# EAGLE design PS2 (EAGLE 8.0.0)
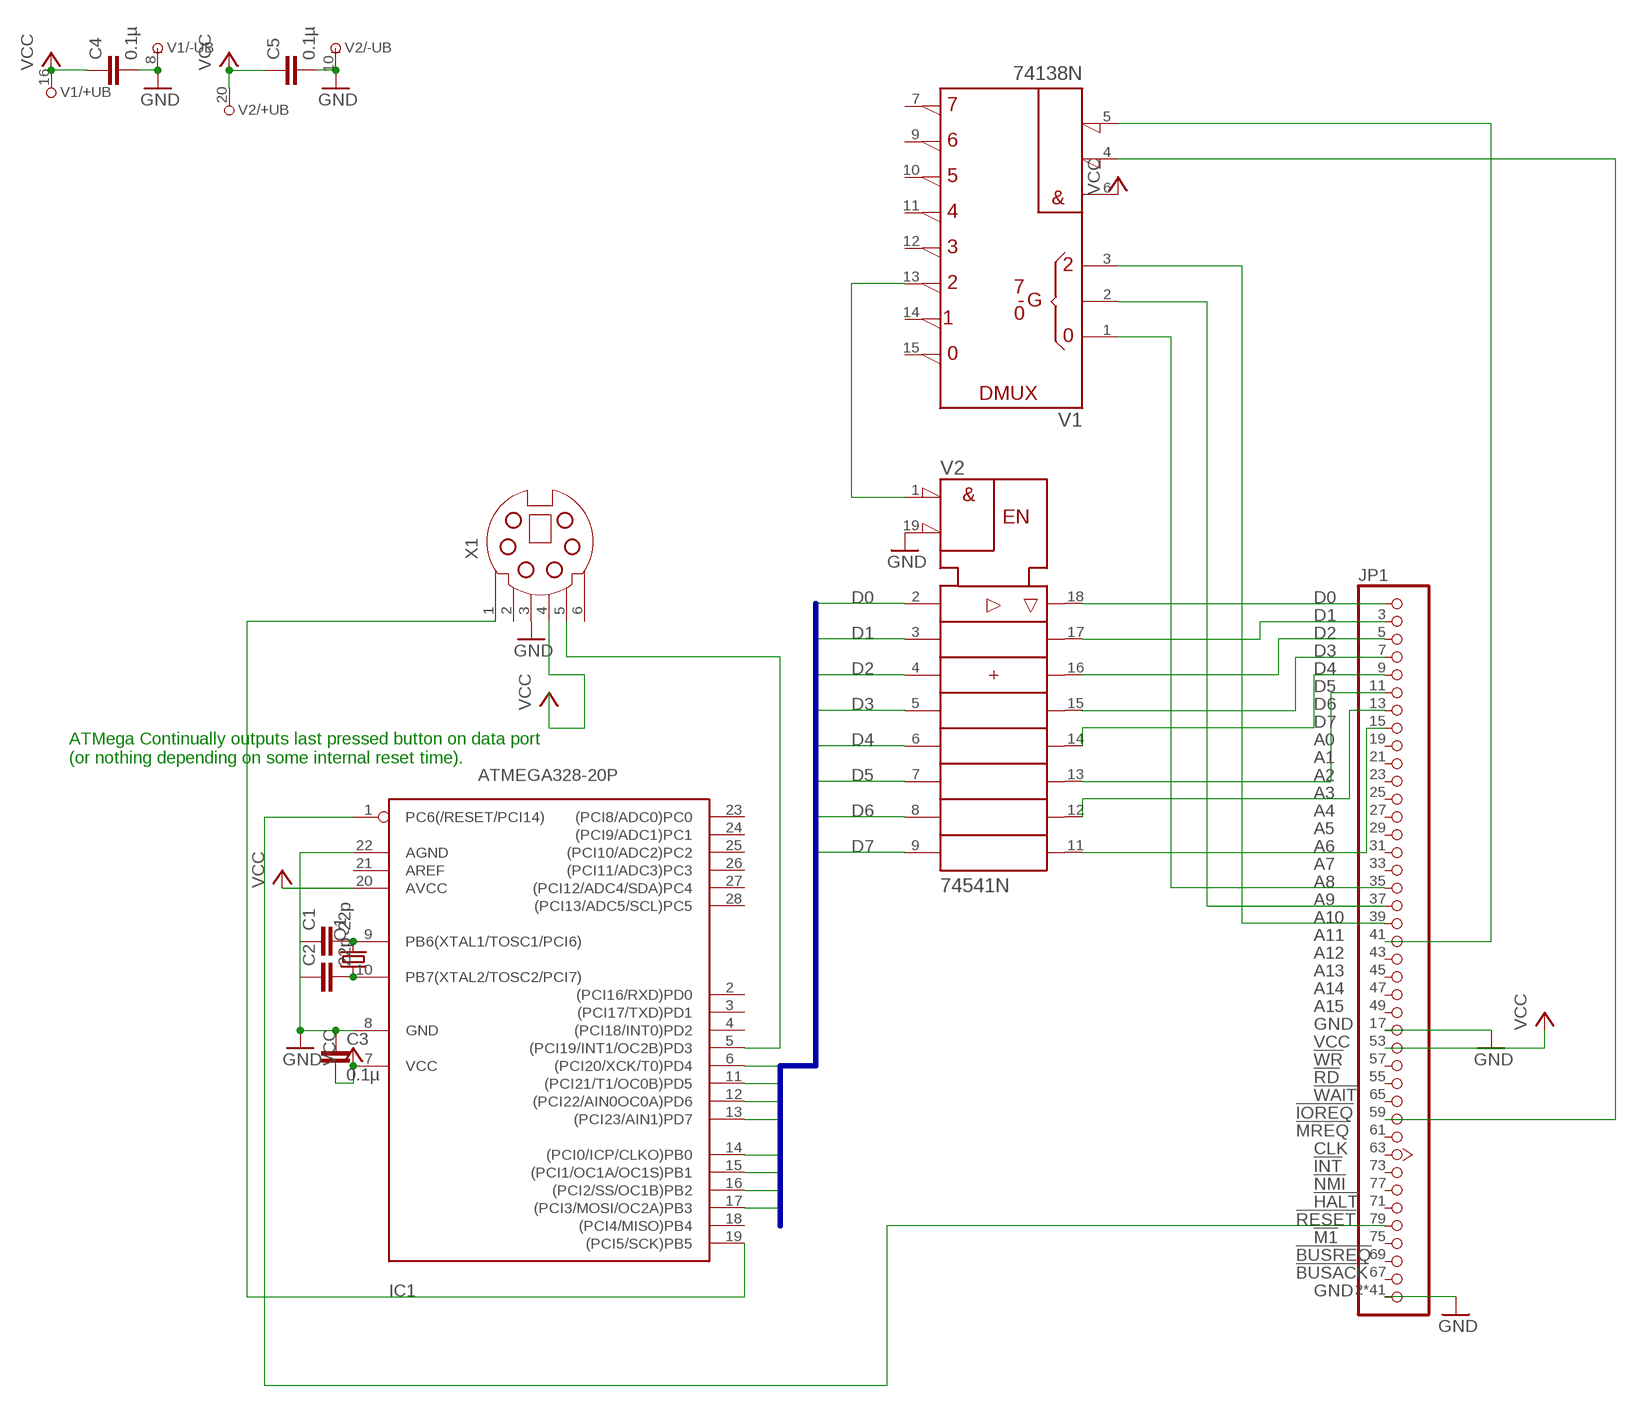
[diagram p0: schematic, sheet 1]

## Parts
C1  22p  C5/3  [C5B3]
C2  22p  C5/3  [C5B3]
C3  0.1µ  C5/3  [C5B3]
C4  0.1µ  C5/3  [C5B3]
C5  0.1µ  C5/3  [C5B3]
IC1  ATMEGA328-20P  [DIL28-3]
JP1  JEANNECTOR/90  [2X25/90]
Q1  CRYSTALHC49S  [HC49/S]
V1  74138N  [DIL16]
V2  74541N  [DIL20]
X1  MDSSV-F06  [SSV-BC06]

## Nets
D0: IC1.6((PCI20/XCK/T0)PD4) V2.2(A1)
D1: IC1.11((PCI21/T1/OC0B)PD5) V2.3(A2)
D2: IC1.12((PCI22/AIN0OC0A)PD6) V2.4(A3)
D3: IC1.13((PCI23/AIN1)PD7) V2.5(A4)
D4: IC1.14((PCI0/ICP/CLKO)PB0) V2.6(A5)
D5: IC1.15((PCI1/OC1A/OC1S)PB1) V2.7(A6)
D6: IC1.16((PCI2/SS/OC1B)PB2) V2.8(A7)
D7: IC1.17((PCI3/MOSI/OC2A)PB3) V2.9(A8)
GND: C3.1 C4.2 C5.2 IC1.8(GND) IC1.22(AGND) JP1.2(GND) JP1.4(GND) JP1.6(GND) JP1.8(GND) JP1.10(GND) JP1.12(GND) JP1.14(GND) JP1.16(GND) JP1.17(GND) JP1.18(GND) JP1.20(GND) JP1.22(GND) JP1.24(GND) JP1.26(GND) JP1.28(GND) JP1.30(GND) JP1.32(GND) JP1.34(GND) JP1.36(GND) JP1.38(GND) JP1.40(GND) JP1.42(GND) JP1.44(GND) JP1.46(GND) JP1.48(GND) JP1.50(GND) JP1.51(GND) JP1.52(GND) JP1.54(GND) JP1.56(GND) JP1.58(GND) JP1.60(GND) JP1.62(GND) JP1.64(GND) JP1.66(GND) JP1.68(GND) JP1.70(GND) JP1.72(GND) JP1.74(GND) JP1.76(GND) JP1.78(GND) JP1.80(GND) V1.8(-UB) V2.10(-UB) V2.19(!G2) X1.3
N$1: JP1.35(A8) V1.1(A)
N$2: JP1.37(A9) V1.2(B)
N$3: JP1.39(A10) V1.3(C)
N$4: IC1.5((PCI19/INT1/OC2B)PD3) X1.5
N$5: V1.13(Y2) V2.1(!G1)
N$6: IC1.19((PCI5/SCK)PB5) X1.1
N$7: JP1.59(!IOREQ) V1.4(!G2A)
N$8: JP1.41(A11) V1.5(!G2B)
N$9: JP1.1(D0) V2.18(Y1)
N$10: JP1.3(D1) V2.17(Y2)
N$11: JP1.5(D2) V2.16(Y3)
N$12: JP1.7(D3) V2.15(Y4)
N$13: JP1.9(D4) V2.14(Y5)
N$14: JP1.11(D5) V2.13(Y6)
N$15: JP1.13(D6) V2.12(Y7)
N$16: JP1.15(D7) V2.11(Y8)
N$17: IC1.1(PC6(/RESET/PCI14)) JP1.79(!RESET)
N$18: C1.2 IC1.9(PB6(XTAL1/TOSC1/PCI6)) Q1.2
N$19: C2.2 IC1.10(PB7(XTAL2/TOSC2/PCI7)) Q1.1
VCC: C3.2 C4.1 C5.1 IC1.7(VCC) IC1.20(AVCC) JP1.53(VCC) V1.6(G1) V1.16(+UB) V2.20(+UB) X1.4
Unconnected: C1.1 C2.1 IC1.2((PCI16/RXD)PD0) IC1.3((PCI17/TXD)PD1) IC1.4((PCI18/INT0)PD2) IC1.18((PCI4/MISO)PB4) IC1.21(AREF) IC1.23((PCI8/ADC0)PC0) IC1.24((PCI9/ADC1)PC1) IC1.25((PCI10/ADC2)PC2) IC1.26((PCI11/ADC3)PC3) IC1.27((PCI12/ADC4/SDA)PC4) IC1.28((PCI13/ADC5/SCL)PC5) JP1.19(A0) JP1.21(A1) JP1.23(A2) JP1.25(A3) JP1.27(A4) JP1.29(A5) JP1.31(A6) JP1.33(A7) JP1.43(A12) JP1.45(A13) JP1.47(A14) JP1.49(A15) JP1.55(!RD) JP1.57(!WR) JP1.61(!MREQ) JP1.63(CLK) JP1.65(!WAIT) JP1.67(!BUSACK) JP1.69(!BUSRQ) JP1.71(!HALT) JP1.73(!INT) JP1.75(!M1) JP1.77(!NMI) V1.7(Y7) V1.9(Y6) V1.10(Y5) V1.11(Y4) V1.12(Y3) V1.14(Y1) V1.15(Y0) X1.2 X1.6

## Buses
D[0..7]

## Notes on the sheet
- ATMega Continually outputs last pressed button on data port
  (or nothing depending on some internal reset time).

## Library data of the parts
C1-C5 = capacitor-wima:C: CAPACITOR naming: grid - package width
IC1 = atmega328:ATMEGA328*P: MICROCONTROLLER 32 kBytes FLASH 2 kBytes SRAM 1 kBytes EEPROM USART 8-channel 10 bit ADC
JP1 = jean:JEANNECTOR: PIN HEADER
Q1 = crystal:CRYSTAL: CRYSTAL; OC_FARNELL: 1667008; OC_NEWARK: unknown
V1 = 74ttl-din:74*138: 3-line to 8-line DECODER/DEMULTIPLEXER
V2 = 74ttl-din:74*541: Octal BUFFER and LINE DRIVER, 3-state
X1 = con-yamaichi:MDSSV-F06: YAMAICHI CONNECTOR; OC_FARNELL: unknown; OC_NEWARK: unknown

## Board
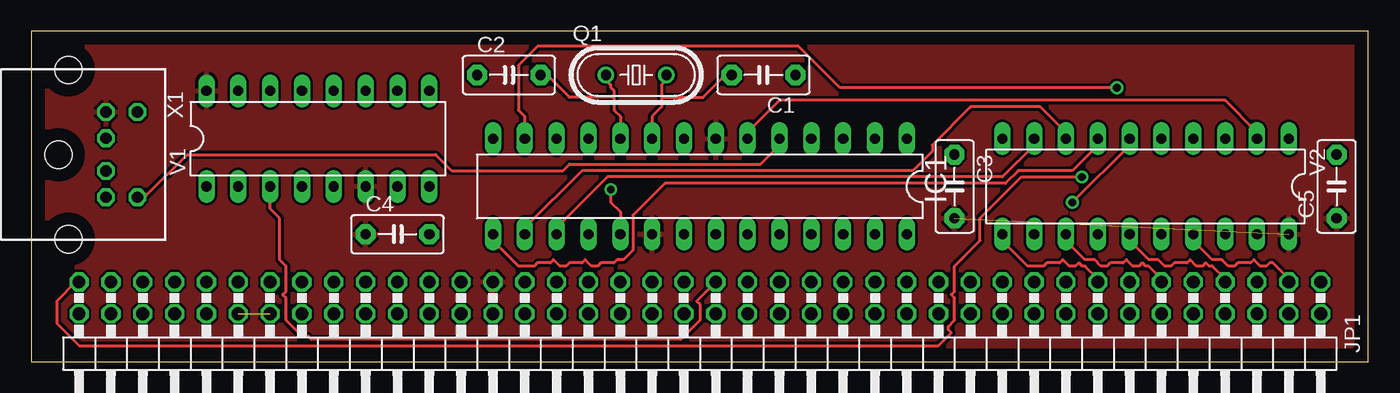
[diagram p1: board, top side]
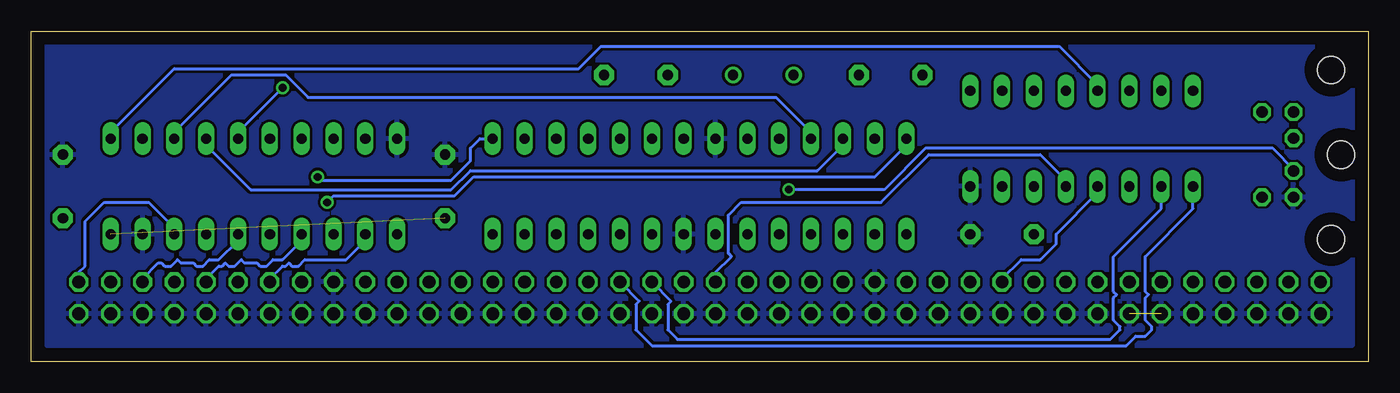
[diagram p2: board, bottom side, seen from below]

Size 106.66 x 26.34 mm. Coordinates in mm from the lower left corner, seen from the top.
Outline: 0,0 106.66,0 106.66,26.34 0,26.34 0,0
Copper layers (1*16): Top 0.035mm / dielectric 1.5mm / Bottom 0.035mm
Design rules "default": minimum track width 10mil, minimum drill 24mil, track to track 8mil, track to pad 8mil, pad to pad 8mil, via to via 8mil, smd to smd 8mil, copper to edge 40mil, drill to drill 8mil, minimum pad ring 10mil, minimum via ring 8mil, stop-mask expansion 4mil, vias tented up to drill 0mil, thermal gap 10mil

### Footprints (pad centres in the part's own frame; a part is rotated, then mirrored left to right if it is on the bottom)
C5B3 = drill 0.813 pad 1.6 octagon: 1 -2.54,0; 2 2.54,0
DIL28-3 = drill 0.813 long: 1 -16.51,-3.81; 2 -13.97,-3.81; 3 -11.43,-3.81; 4 -8.89,-3.81; 5 -6.35,-3.81; 6 -3.81,-3.81; 7 -1.27,-3.81; 8 1.27,-3.81; 9 3.81,-3.81; 10 6.35,-3.81; 11 8.89,-3.81; 12 11.43,-3.81; 13 13.97,-3.81; 14 16.51,-3.81; 15 16.51,3.81; 16 13.97,3.81; 17 11.43,3.81; 18 8.89,3.81; 19 6.35,3.81; 20 3.81,3.81; 21 1.27,3.81; 22 -1.27,3.81; 23 -3.81,3.81; 24 -6.35,3.81; 25 -8.89,3.81; 26 -11.43,3.81; 27 -13.97,3.81; 28 -16.51,3.81
2X25/90 = drill 1.016 octagon: 1 -29.21,-6.35; 2 -29.21,-3.81; 3 -26.67,-6.35; 4 -26.67,-3.81; 5 -24.13,-6.35; 6 -24.13,-3.81; 7 -21.59,-6.35; 8 -21.59,-3.81; 9 -19.05,-6.35; 10 -19.05,-3.81; 11 -16.51,-6.35; 12 -16.51,-3.81; 13 -13.97,-6.35; 14 -13.97,-3.81; 15 -11.43,-6.35; 16 -11.43,-3.81; 17 -8.89,-6.35; 18 -8.89,-3.81; 19 -6.35,-6.35; 20 -6.35,-3.81; 21 -3.81,-6.35; 22 -3.81,-3.81; 23 -1.27,-6.35; 24 -1.27,-3.81; 25 1.27,-6.35; 26 1.27,-3.81; 27 3.81,-6.35; 28 3.81,-3.81; 29 6.35,-6.35; 30 6.35,-3.81; 31 8.89,-6.35; 32 8.89,-3.81; 33 11.43,-6.35; 34 11.43,-3.81; 35 13.97,-6.35; 36 13.97,-3.81; 37 16.51,-6.35; 38 16.51,-3.81; 39 19.05,-6.35; 40 19.05,-3.81; 41 21.59,-6.35; 42 21.59,-3.81; 43 24.13,-6.35; 44 24.13,-3.81; 45 26.67,-6.35; 46 26.67,-3.81; 47 29.21,-6.35; 48 29.21,-3.81; 49 31.75,-6.35; 50 31.75,-3.81; 51 34.29,-6.35; 52 34.29,-3.81; 53 36.83,-6.35; 54 36.83,-3.81; 55 39.37,-6.35; 56 39.37,-3.81; 57 41.91,-6.35; 58 41.91,-3.81; 59 44.45,-6.35; 60 44.45,-3.81; 61 46.99,-6.35; 62 46.99,-3.81; 63 49.53,-6.35; 64 49.53,-3.81; 65 52.07,-6.35; 66 52.07,-3.81; 67 54.61,-6.35; 68 54.61,-3.81; 69 57.15,-6.35; 70 57.15,-3.81; 71 59.69,-6.35; 72 59.69,-3.81; 73 62.23,-6.35; 74 62.23,-3.81; 75 64.77,-6.35; 76 64.77,-3.81; 77 67.31,-6.35; 78 67.31,-3.81; 79 69.85,-6.35; 80 69.85,-3.81
HC49/S = drill 0.813: 1 -2.413,0; 2 2.413,0
DIL16 = drill 0.813 long: 1 -8.89,-3.81; 2 -6.35,-3.81; 3 -3.81,-3.81; 4 -1.27,-3.81; 5 1.27,-3.81; 6 3.81,-3.81; 7 6.35,-3.81; 8 8.89,-3.81; 9 8.89,3.81; 10 6.35,3.81; 11 3.81,3.81; 12 1.27,3.81; 13 -1.27,3.81; 14 -3.81,3.81; 15 -6.35,3.81; 16 -8.89,3.81
DIL20 = drill 0.813 long: 1 -11.43,-3.81; 2 -8.89,-3.81; 3 -6.35,-3.81; 4 -3.81,-3.81; 5 -1.27,-3.81; 6 1.27,-3.81; 7 3.81,-3.81; 8 6.35,-3.81; 9 8.89,-3.81; 10 11.43,-3.81; 11 11.43,3.81; 12 8.89,3.81; 13 6.35,3.81; 14 3.81,3.81; 15 1.27,3.81; 16 -1.27,3.81; 17 -3.81,3.81; 18 -6.35,3.81; 19 -8.89,3.81; 20 -11.43,3.81
SSV-BC06 = drill 0.9 octagon: 1 1.3,8.5; 2 -1.3,8.5; 3 3.4,8.5; 4 -3.4,8.5; 5 3.4,11; 6 -3.4,11 | hole 2.2: -6.75,5.5; 0,4.7; 6.75,5.5

### Placement (x,y rotation side)
C1  58.42,22.86 180 top
C2  38.1,22.86 0 top
C3  73.66,13.97 270 top
C4  29.21,10.16 0 top
C5  104.14,13.97 90 top
IC1  53.34,13.97 180 top
JP1  73.66,0 180 top
Q1  48.26,22.86 0 top
V1  22.86,17.78 0 top
V2  88.9,13.97 180 top
X1  -2.54,16.51 270 top

### Tracks (layer width: path | path; a pad name or v marks a point on that pad's centre or on a via)
D0
  Top 0.254: IC1.6 57.15,18.29 59.69,20.83 95.25,20.83 97.79,18.29 V2.2
D1
  Bottom 0.254: IC1.11 44.45,18.29 47.24,21.08 84.58,21.08 86.36,22.86 90.68,22.86 95.25,18.29 V2.3
D2
  Bottom 0.254: IC1.12 41.91,17.27 43.94,15.24 71.63,15.24 73.15,13.72 89.15,13.72 92.71,17.27 V2.4
D3  (via drill 0.61)
  Top 0.254: IC1.13 39.37,19.56 38.86,20.07 38.86,23.62 40.39,25.15 61.21,25.15 64.52,21.84 v86.61,21.84
  Bottom 0.254: v86.61,21.84 90.17,18.29 V2.5
D4  (via drill 0.61)
  Top 0.254: v83.06,12.7 87.63,17.27 V2.6
  Bottom 0.254: IC1.14 36.83,17.27 39.37,14.73 71.37,14.73 72.9,13.21 82.55,13.21 v83.06,12.7
D5
  Top 0.254: IC1.15 36.83,9.65 38.86,7.62 40.13,7.62 40.39,7.87 41.4,7.87 41.66,8.13 42.16,7.62 42.67,7.62 42.93,7.87 43.94,7.87 44.2,8.13 44.7,7.62 45.21,7.62 45.47,7.87 46.48,7.87 46.74,8.13 47.24,8.13 48.01,8.89 48.01,11.68 50.55,14.22 77.72,14.22 78.74,15.24 83.06,15.24 85.09,17.27 V2.7
D6
  Top 0.254: IC1.16 39.37,10.67 43.94,15.24 70.36,15.24 71.88,16.76 71.88,17.27 74.93,20.32 80.52,20.32 82.55,18.29 V2.8
D7
  Top 0.254: IC1.17 41.91,10.67 45.97,14.73 77.47,14.73 80.01,17.27 V2.9
GND  (1 unrouted)
  pour Bottom: 1.27,25.4 1.27,1.27 105.41,1.27 105.41,25.4
N$1
  Bottom 0.254: V1.1 13.97,12.19 17.78,8.38 17.78,5.59 17.53,5.33 17.78,5.08 17.78,3.3 17.27,2.79 17.27,2.54 17.78,2.03 18.54,2.03 19.3,1.27 57.15,1.27 58.42,2.54 58.42,4.57 58.17,4.83 JP1.35
N$2
  Bottom 0.254: V1.2 16.51,12.19 20.32,8.38 20.32,5.59 20.07,5.33 20.32,5.08 20.32,3.3 19.81,2.79 19.81,2.54 20.57,1.78 55.12,1.78 55.88,2.54 55.88,4.57 55.63,4.83 JP1.37
N$3
  Top 0.254: V1.3 19.05,12.19 19.81,11.43 19.81,8.13 20.32,7.62 20.32,5.59 20.07,5.33 20.32,5.08 20.32,3.3 21.59,2.03 22.1,2.03 22.35,1.78 51.82,1.78 53.34,3.3 53.34,4.57 53.09,4.83 JP1.39
N$4
  Top 0.254: IC1.5 59.69,17.27 58.17,15.75 42.93,15.75 42.42,15.24 33.53,15.24 32.26,16.51 12.45,16.51 9.14,13.21 8.64,13.21 X1.5
N$5
  Bottom 0.254: V1.13 21.59,22.1 24.64,25.15 61.21,25.15 62.99,23.37 95.25,23.37 100.33,18.29 V2.1
N$6  (via drill 0.61)
  Top 0.254: IC1.19 46.99,11.94 46.23,12.7 v46.23,13.72
  Bottom 0.254: v46.23,13.72 38.61,13.72 35.31,17.02 7.62,17.02 5.84,15.24 X1.1
N$7
  Bottom 0.254: V1.4 21.59,13.46 24.89,10.16 24.89,9.4 26.16,8.13 27.69,8.13 29.21,6.6 JP1.59
N$8
  Bottom 0.254: V1.5 24.13,14.48 26.16,16.51 35.05,16.51 38.86,12.7 50.04,12.7 51.05,11.68 51.05,8.64 50.8,8.38 52.07,7.11 JP1.41
N$9
  Bottom 0.254: V2.18 95.25,10.67 97.28,12.7 100.84,12.7 102.36,11.18 102.36,7.62 102.87,7.11 JP1.1
N$10
  Top 0.254: V2.17 92.71,9.65 94.23,8.13 95,8.13 95.5,7.62 96.01,7.62 96.27,7.87 97.28,7.87 97.54,8.13 98.04,7.62 98.55,7.62 98.81,7.87 99.06,7.87 100.33,6.6 JP1.3
N$11
  Bottom 0.254: V2.16 90.17,9.65 91.69,8.13 92.46,8.13 92.96,7.62 93.47,7.62 93.73,7.87 94.74,7.87 95,8.13 95.5,7.62 96.01,7.62 96.27,7.87 96.52,7.87 97.79,6.6 JP1.5
N$12
  Top 0.254: V2.15 87.63,9.65 89.15,8.13 89.92,8.13 90.42,7.62 90.93,7.62 91.19,7.87 92.2,7.87 92.46,8.13 92.96,7.62 93.47,7.62 93.73,7.87 93.98,7.62 94.23,7.62 95.25,6.6 JP1.7
N$13
  Bottom 0.254: V2.14 85.09,9.65 86.61,8.13 87.38,8.13 87.88,7.62 88.39,7.62 88.65,7.87 89.66,7.87 89.92,8.13 90.42,7.62 90.93,7.62 91.19,7.87 91.44,7.62 91.69,7.62 92.71,6.6 JP1.9
N$14
  Top 0.254: V2.13 82.55,9.65 84.07,8.13 84.84,8.13 85.34,7.62 85.85,7.62 86.11,7.87 87.12,7.87 87.38,8.13 87.88,7.62 88.39,7.62 88.65,7.87 88.9,7.62 89.15,7.62 90.17,6.6 JP1.11
N$15
  Bottom 0.254: V2.12 80.01,9.65 81.53,8.13 84.84,8.13 85.34,7.62 85.85,7.62 86.11,7.87 86.36,7.62 86.61,7.62 87.63,6.6 JP1.13
N$16
  Top 0.254: V2.11 77.47,9.65 79.5,7.62 80.77,7.62 81.03,7.87 82.04,7.87 82.3,8.13 82.8,7.62 83.31,7.62 83.57,7.87 83.82,7.62 84.07,7.62 85.09,6.6 JP1.15
N$17  (via drill 0.61)
  Top 0.254: v83.82,14.73 78.99,14.73 75.69,11.43 75.69,9.65 73.66,7.62 73.66,5.59 73.41,5.33 73.66,5.08 73.66,3.3 73.15,2.79 73.15,2.54 73.41,2.29 72.39,1.27 3.81,1.27 2.03,3.05 2.03,4.83 3.56,6.35 JP1.79
  Bottom 0.254: IC1.1 70.87,17.78 71.63,17.02 71.63,16 73.15,14.48 83.57,14.48 v83.82,14.73
N$18
  Top 0.254: IC1.9 49.53,19.56 50.29,20.32 50.29,21.08 | 50.29,21.08 50.29,22.1 50.55,22.35 50.55,22.86 Q1.2 | C1.2 55.37,22.86 53.59,21.08 50.29,21.08
N$19
  Top 0.254: IC1.10 46.99,19.56 46.48,20.07 46.48,21.08 | 46.48,21.08 46.48,21.59 46.23,21.84 46.23,22.1 45.97,22.35 45.97,22.86 Q1.1 | C2.2 41.15,22.86 42.93,21.08 46.48,21.08
VCC  (1 unrouted)
  pour Top: 1.27,25.4 1.27,1.27 105.41,1.27 105.41,25.4